# Altium project LM_002_TEST.PrjPcb
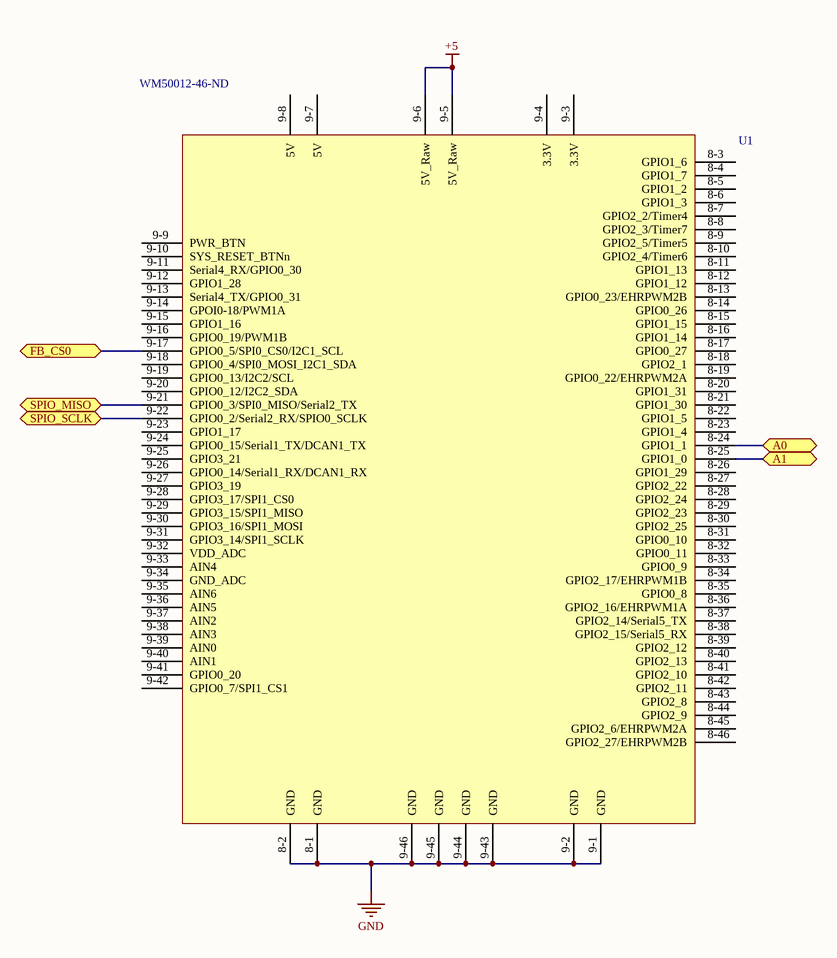
[diagram p0: BBB.SchDoc]
2 sheets, 17 parts. Net scope: flat (ports and power ports of the same name join across sheets).
Board file: LM_002_TEST.PcbDoc
Sheets:
  BBB.SchDoc
  Connectors.SchDoc

## Sheet BBB.SchDoc: FB Test Board
size OrCAD A; DocumentNumber: LM-002-TEST; Revision: A; SheetNumber: 1; SheetTotal: 2

### Parts
U1  Supplier Part Number 1: WM50012-46-ND  [Beaglebone Black]  (hidden comment: BBB)

### Ports
A0, A1, FB_CS0, SPIO_MISO, SPIO_SCLK

### Nets
+5: U1.9-5(5V_Raw) U1.9-6(5V_Raw)
GND: U1.8-1(GND) U1.8-2(GND) U1.9-1(GND) U1.9-2(GND) U1.9-43(GND) U1.9-44(GND) U1.9-45(GND) U1.9-46(GND)
A0: U1.8-24(GPIO1_1) ; port A0
A1: U1.8-25(GPIO1_0) ; port A1
SPI0_MISO: U1.9-21(GPIO0_3/SPI0_MISO/Serial2_TX) ; port SPIO_MISO
SPI0_SCLK: U1.9-22(GPIO0_2/Serial2_RX/SPIO0_SCLK) ; port SPIO_SCLK
NetP3_9: U1.9-17(GPIO0_5/SPI0_CS0/I2C1_SCL) ; port FB_CS0

Not connected (* = marked no-connect by the designer): U1 8-3(GPIO1_6) 8-4(GPIO1_7) 8-5(GPIO1_2) 8-6(GPIO1_3) 8-7(GPIO2_2/Timer4) 8-8(GPIO2_3/Timer7) 8-9(GPIO2_5/Timer5) 8-10(GPIO2_4/Timer6) 8-11(GPIO1_13) 8-12(GPIO1_12) 8-13(GPIO0_23/EHRPWM2B) 8-14(GPIO0_26) 8-15(GPIO1_15) 8-16(GPIO1_14) 8-17(GPIO0_27) 8-18(GPIO2_1) 8-19(GPIO0_22/EHRPWM2A) 8-20(GPIO1_31) 8-21(GPIO1_30) 8-22(GPIO1_5) 8-23(GPIO1_4) 8-26(GPIO1_29) 8-27(GPIO2_22) 8-28(GPIO2_24) 8-29(GPIO2_23) 8-30(GPIO2_25) 8-31(GPIO0_10) 8-32(GPIO0_11) 8-33(GPIO0_9) 8-34(GPIO2_17/EHRPWM1B) 8-35(GPIO0_8) 8-36(GPIO2_16/EHRPWM1A) 8-37(GPIO2_14/Serial5_TX) 8-38(GPIO2_15/Serial5_RX) 8-39(GPIO2_12) 8-40(GPIO2_13) 8-41(GPIO2_10) 8-42(GPIO2_11) 8-43(GPIO2_8) 8-44(GPIO2_9) 8-45(GPIO2_6/EHRPWM2A) 8-46(GPIO2_27/EHRPWM2B) 9-3(3.3V) 9-4(3.3V) 9-7(5V) 9-8(5V) 9-9(PWR_BTN) 9-10(SYS_RESET_BTNn) 9-11(Serial4_RX/GPIO0_30) 9-12(GPIO1_28) 9-13(Serial4_TX/GPIO0_31) 9-14(GPOI0-18/PWM1A) 9-15(GPIO1_16) 9-16(GPIO0_19/PWM1B) 9-18(GPIO0_4/SPI0_MOSI_I2C1_SDA) 9-19(GPIO0_13/I2C2/SCL) 9-20(GPIO0_12/I2C2_SDA) 9-23(GPIO1_17) 9-24(GPIO0_15/Serial1_TX/DCAN1_TX) 9-25(GPIO3_21) 9-26(GPIO0_14/Serial1_RX/DCAN1_RX) 9-27(GPIO3_19) 9-28(GPIO3_17/SPI1_CS0) 9-29(GPIO3_15/SPI1_MISO) 9-30(GPIO3_16/SPI1_MOSI) 9-31(GPIO3_14/SPI1_SCLK) 9-32(VDD_ADC) 9-33(AIN4) 9-34(GND_ADC) 9-35(AIN6) 9-36(AIN5) 9-37(AIN2) 9-38(AIN3) 9-39(AIN0) 9-40(AIN1) 9-41(GPIO0_20) 9-42(GPIO0_7/SPI1_CS1)

### Notes on the sheet
- Title
- Size:
- Date:
- Orcad A
- Number:
- Time:
- Revision:
- Sheet
- of
- ZLS Corporation
- 7801 North Lamar Blvd.
- Suite E-184
- Austin, Texas 78752  USA
- (512) 453-0288
- File:

### Library data of the parts
U1 = Beaglebone_Black: Beaglebone Black; Manufacturer: Molex, LLC; Manufacturer Part Number: 0010897462; Connector Type: Header, Breakaway; Pitch - Mating: 0.100" (2.54mm); Style: Board to Board or Cable; Shrouding: Unshrouded; Number of Positions: 46; Number of Positions Loaded: All; Contact Length - Mating: 0.240" (6.10mm); Contact Length - Post: 0.107" (2.71mm); Overall Contact Length: 0.437" (11.10mm); Material Flammability Rating: UL94 V-0; Supplier 1: Digi-Key; RoHS: RoHS Compliant; Category: Connectors, Interconnects; Stock 1: 407; Pricing 1: 1=7.65, 10=7.336, 25=6.698, 50=6.379, 100=6.0601, 250=5.4222, 500=5.10324 (USD); Packaging: Bulk; Part Status: Active; Contact Type: Male Pin; Number of Rows: 2; Row Spacing - Mating: 0.100" (2.54mm); Mounting Type: Through Hole; Termination: Solder; Fastening Type: -; Insulation Height: 0.090" (2.29mm); Contact Shape: Square; Contact Finish - Mating: Gold; Contact Finish Thickness - Mating: 15µin (0.38µm); Contact Finish - Post: Tin; Contact Material: Copper Alloy; Insulation Material: Liquid Crystal Polymer (LCP), Glass Filled; Features: -; Operating Temperature: -; Ingress Protection: -; Insulation Color: Black; Current Rating: -; Voltage Rating: -; Mated Stacking Heights: -; Contact Finish Thickness - Post: 74.8µin (1.90µm); Applications: Automotive, General Purpose, Lighting, Medical, Telecommunications; ComponentLink1URL: http://www.molex.com/pdm_docs/sd/010897041_sd.pdf; ComponentLink1Description: http://www.molex.com/pdm_docs/sd/010897041_sd.pdf

## Sheet Connectors.SchDoc
size OrCAD A
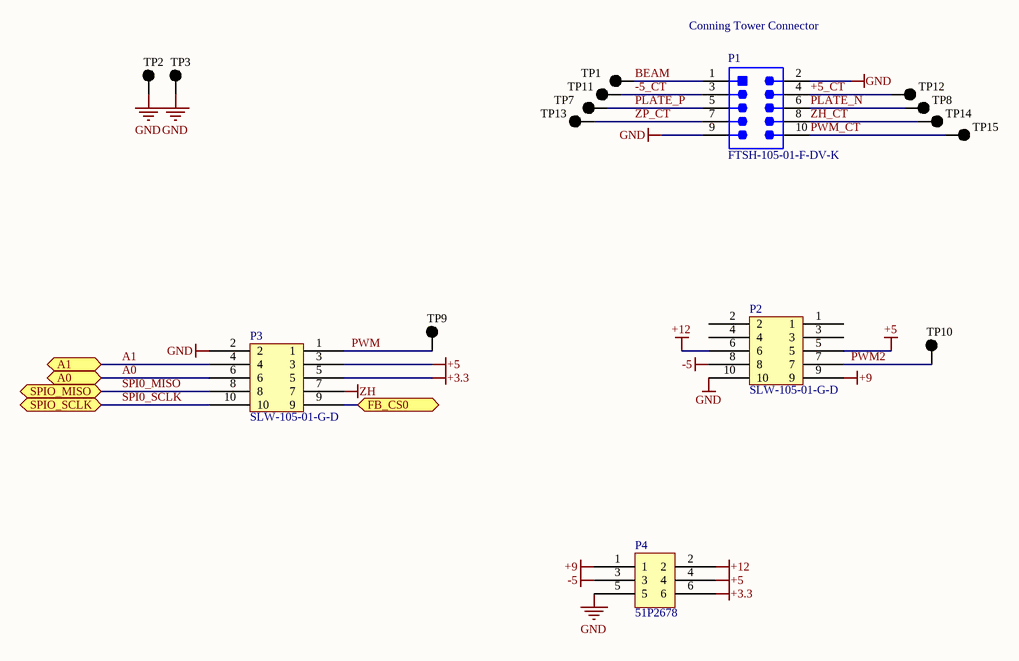
[diagram p1: Connectors.SchDoc]

### Parts
P1  FTSH-105-01-F-DV-K  [SMTC-FTSH-105-01-L-DV-K_V]
P2  SLW-105-01-G-D  [SLW-105-01-G-D]
P3  SLW-105-01-G-D  [SLW-105-01-G-D]
P4  Supplier Part Number 1: 51P2678  [IPL1-103-01-F-D]  (hidden comment: IPL1-103-01-F-D)
TP1  5011  [KSTN-5011_V]  (value not drawn)
TP2  5011  [KSTN-5011_V]  (value not drawn)
TP3  5011  [KSTN-5011_V]  (value not drawn)
TP7  5011  [KSTN-5011_V]  (value not drawn)
TP8  5011  [KSTN-5011_V]  (value not drawn)
TP9  5011  [KSTN-5011_V]  (value not drawn)
TP10  5011  [KSTN-5011_V]  (value not drawn)
TP11  5011  [KSTN-5011_V]  (value not drawn)
TP12  5011  [KSTN-5011_V]  (value not drawn)
TP13  5011  [KSTN-5011_V]  (value not drawn)
TP14  5011  [KSTN-5011_V]  (value not drawn)
TP15  5011  [KSTN-5011_V]  (value not drawn)

### Ports
A0, A1, FB_CS0, SPIO_MISO, SPIO_SCLK

### Nets
+3.3: P3.5 P4.6
+5: P2.5 P3.3 P4.4
+9: P2.9 P4.1
+12: P2.6 P4.2
-5: P2.8 P4.3
GND: P1.2 P1.9 P2.10 P3.2 P4.5 TP2.1 TP3.1
ZH: P3.7
+5_CT: P1.4 TP12.1
-5_CT: P1.3 TP11.1
A0: P3.6 ; port A0
A1: P3.4 ; port A1
BEAM: P1.1 TP1.1
PLATE_N: P1.6 TP8.1
PLATE_P: P1.5 TP7.1
PWM: P3.1 TP9.1
PWM2: P2.7 TP10.1
PWM_CT: P1.10 TP15.1
SPI0_MISO: P3.8 ; port SPIO_MISO
SPI0_SCLK: P3.10 ; port SPIO_SCLK
ZH_CT: P1.8 TP14.1
ZP_CT: P1.7 TP13.1
NetP3_9: P3.9 ; port FB_CS0

Not connected (* = marked no-connect by the designer): P2 1 2 3 4

### Notes on the sheet
- (near P1) Conning Tower Connector
- Title
- Size:
- Date:
- Orcad A
- Number:
- Time:
- Revision:
- Sheet
- of
- ZLS Corporation
- 7801 North Lamar Blvd.
- Suite E-184
- Austin, Texas 78752  USA
- (512) 453-0288
- File:

### Library data of the parts
P1 = CMP-2000-05352-1: Male Header, Pitch 1.27 mm, 2 x 5 Position, Height 6.12 mm, RoHS, Tube; Manufacturer: Samtec; Number of Positions: 10; Connector Type: Header,Shrouded; Number of Positions Loaded: All; Fastening Type: -; Package Reference: FTSH-105-01-L-DV-K; Termination: Solder; Package URL: http://suddendocs.samtec.com/prints/ftsh-1xx-xx-xxx-dv-xxx-footprint.pdf; Number of Rows: 2; Contact Finish Thickness: 3µin(0.08µm); Contact Type: MalePin; Manufacturer URL: http://www.samtec.com/; Series: FTSH; Features: -; Contact Finish: Gold; Color: Black; Family: RectangularConnectors-Headers,MalePins; Datasheet URL: http://suddendocs.samtec.com/prints/ftsh-1xx-xx-xxx-dv-xxx-mkt.pdf; Package Description: Male Header, Pitch 1.27 mm, 2 x 5 Position, Height 5.97 mm, Tail Length 4.32 mm; Mounting Type: SurfaceMount; Datasheet Version: Rev. ET, 10/1995; Category: Connectors,Interconnects; Packaging: Tube
P2 P3 = SLW-105-01-G-D: CONN RCPT .100" 10POS DUAL GOLD; Manufacturer: Samtec Inc.; Connector Type: Receptacle; Style: Board to Board; Number of Positions: 10; Number of Positions Loaded: All; Pitch - Mating: 0.100" (2.54mm); Contact Length - Post: 0.115" (2.92mm); Mated Stacking Heights: 6.09mm; Supplier 1: Digi-Key; Supplier Part Number 1: SAM1088-05-ND; Manufacturer Part Number: SLW-105-01-G-D; RoHS: RoHS Compliant; Category: Connectors, Interconnects; Stock 1: 203; Pricing 1: 1=3.8, 10=3.401, 100=2.8012, 500=2.2143, 1000=1.90084, 5000=1.7341, 10000=1.6674 (USD); Packaging: Bulk; Part Status: Active; Contact Type: Forked; Row Spacing - Mating: 0.100" (2.54mm); Mounting Type: Through Hole; Termination: Solder; Fastening Type: Push-Pull; Contact Finish - Mating: Gold; Contact Finish Thickness - Mating: 20µin (0.51µm); Insulation Color: Black; Insulation Height: 0.180" (4.57mm); Operating Temperature: -55°C ~ 125°C; Material Flammability Rating: -; Contact Finish - Post: Gold; Ingress Protection: -; Features: -; Current Rating: -; Voltage Rating: -; Applications: -; Insulation Material: Polyester, Glass Filled; Contact Shape: Square; Contact Material: Phosphor Bronze; Contact Finish Thickness - Post: 3µin (0.08µm); ComponentLink1URL: http://suddendocs.samtec.com/prints/slw-1xx-01-x-x-mkt.pdf; ComponentLink1Description: http://suddendocs.samtec.com/prints/slw-1xx-01-x-x-mkt.pdf
TP1-TP3 TP7-TP15 = CMP-1672-00003-4: Test Point, Black, Through Hole, RoHS, Bulk; Manufacturer: Keystone; ComponentLink2URL: http://www.keyelco.com/product-pdf.cfm?p=1320; Colour: Black; Pins: 1; REACH SVHC: No SVHC; ComponentLink1URL: http://www.keyelco.com/; PackageReference: 5011; Contact Plating: Silver; Package Quantity: 100; Packaging: Bulk; RoHSCompliant: true; Height: 8.12 mm; PackageDescription: 1-Pin Through Hole Device, Dia 3.17 mm; Mount: Through Hole; Mounting Technology: Through Hole; DatasheetVersion: Rev. F, 12/2013; ComponentLink1Description: Manufacturer URL; Contact Material: Bronze; ComponentLink2Description: Datasheet
P4 = IPL1-103-01-F-D: Supplier 1: Newark

## Nets that join several sheets
+5: BBB (U1.9-5 U1.9-6), Connectors (P2.5 P3.3 P4.4)
GND: BBB (8 pins), Connectors (7 pins)
A0: BBB (U1.8-24), Connectors (P3.6)
A1: BBB (U1.8-25), Connectors (P3.4)
NetP3_9: BBB (U1.9-17), Connectors (P3.9)
SPI0_MISO: BBB (U1.9-21), Connectors (P3.8)
SPI0_SCLK: BBB (U1.9-22), Connectors (P3.10)